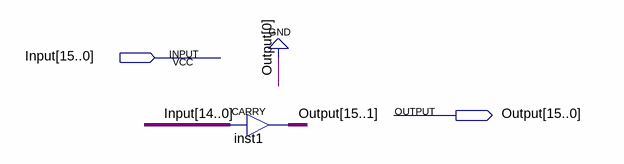
[diagram p0: schematic sheet]
// Quartus schematic Shift_Left_1bit.bdf as structural Verilog: 1 symbols, 2 pins
module Shift_Left_1bit (
  input  [15:0] Input,
  output [15:0] Output
);

  CARRY inst1[14:0] (.IN(Input[14:0]), .OUT(Output[15:1]));

  assign Output[0] = 1'b0;
endmodule
